# Altium schematic sheet draft.SchDoc
size A4; SheetNumber: 1; SheetTotal: 1
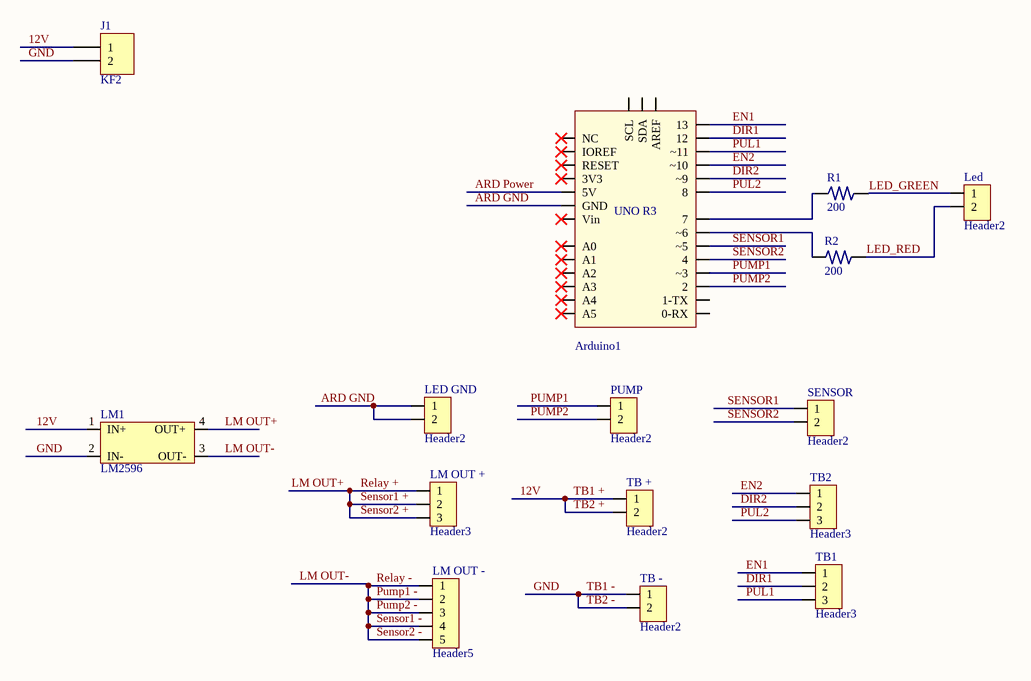
[diagram p0: draft.SchDoc]

## Parts
Arduino1  Arduino Uno R3  [Arduino UNO R3]  (value not drawn)
J1  KF2  [KF2-3.5]
Led  Header2  [HDR2]
LED_GND  Header2  [HDR2]
LM1  LM2596  [LM2596_Module]
LM_OUT_+  Header3  [HDR3]
LM_OUT_-  Header5  [HDR5]
PUMP  Header2  [HDR2]
R1  200  [RESISTOR 1/4W]
R2  200  [RESISTOR 1/4W]
SENSOR  Header2  [HDR2]
TB1  Header3  [HDR3]
TB2  Header3  [HDR3]
TB_+  Header2  [HDR2]
TB_-  Header2  [HDR2]

## Nets
12V: J1.1 LM1.1(IN+) TB_+.1 TB_+.2  [also labelled TB1 +, TB2 +]
ARD GND: Arduino1.GND LED_GND.1 LED_GND.2
ARD Power: Arduino1.5V
DIR1: Arduino1.12 TB1.2
DIR2: Arduino1.~9 TB2.2
EN1: Arduino1.13 TB1.1
EN2: Arduino1.~10 TB2.1
GND: J1.2 LM1.2(IN-) TB_-.1 TB_-.2  [also labelled TB1 -, TB2 -]
LED_GREEN: Led.1 R1.2
LED_RED: Led.2 R2.2
LM OUT+: LM1.4(OUT+) LM_OUT_+.1 LM_OUT_+.2 LM_OUT_+.3  [also labelled Relay +, Sensor1 +, Sensor2 +]
LM OUT-: LM1.3(OUT-) LM_OUT_-.1 LM_OUT_-.2 LM_OUT_-.3 LM_OUT_-.4 LM_OUT_-.5  [also labelled Pump1 -, Pump2 -, Relay -, Sensor1 -, Sensor2 -]
PUL1: Arduino1.~11 TB1.3
PUL2: Arduino1.8 TB2.3
PUMP1: Arduino1.~3 PUMP.1
PUMP2: Arduino1.2 PUMP.2
SENSOR1: Arduino1.~5 SENSOR.1
SENSOR2: Arduino1.4 SENSOR.2
NetArduino1_7: Arduino1.7 R1.1
NetArduino1_~6: Arduino1.~6 R2.1

Not connected (* = marked no-connect by the designer): Arduino1 0-RX 1-TX 3V3* A0* A1* A2* A3* A4* A5* AREF IOREF* NC* RESET* SCL SDA Vin*

## Notes on the sheet
- (in symbol Arduino Uno R3) UNO R3

## Library data of the parts
Arduino1 = Arduino Uno R3: Value: Cau 1A
J1 = KF2: Manufacturer: Würth Elektronik eiSos GmbH; partNo: 691103110002; ComponentLink1 Description: Manufacturer; ComponentLink2 Description: Datasheet; NoPins: 2; Created Date: 29 October 2013; ComponentLink1URL: http://www.we-online.com; ComponentLink2URL: http://katalog.we-online.de/em/datasheet/6911031100xx.pdf; Created by: Karrer Zheng
Led LED_GND PUMP SENSOR TB_+ TB_- = Header2: Header IDC, 2 x 1 Pin Vertical 2.54mm Pitch (Non-Boxed, Male); Manufacturer: W¨¹rth Elektronik eiSos GmbH; partNo: 613002143121; ComponentLink1 Description: Manufacturer; ComponentLink2 Description: Datasheet; NoPins: 02; Created Date: 29 March 2013; ComponentLink1URL: http://www.we-online.com; ComponentLink2URL: http://katalog.we-online.de/em/datasheet/6130xx143121.pdf; Created by: Karrer Zheng
LM1 = LM2596_Module
LM_OUT_+ TB1 TB2 = Header3: Header IDC, 3 x 1 Pin Vertical 2.54mm Pitch (Non-Boxed, Male); Manufacturer: W¨¹rth Elektronik eiSos GmbH; partNo: 613002143121; ComponentLink1 Description: Manufacturer; ComponentLink2 Description: Datasheet; NoPins: 02; Created Date: 29 March 2013; ComponentLink1URL: http://www.we-online.com; ComponentLink2URL: http://katalog.we-online.de/em/datasheet/6130xx143121.pdf; Created by: Karrer Zheng
LM_OUT_- = Header5: Header IDC, 5 x 1 Pin Vertical 2.54mm Pitch (Non-Boxed, Male); Manufacturer: W¨¹rth Elektronik eiSos GmbH; partNo: 613002143121; ComponentLink1 Description: Manufacturer; ComponentLink2 Description: Datasheet; NoPins: 02; Created Date: 29 March 2013; ComponentLink1URL: http://www.we-online.com; ComponentLink2URL: http://katalog.we-online.de/em/datasheet/6130xx143121.pdf; Created by: Karrer Zheng
R1 R2 = RESISTOR: Walt: 1/4W; Value: 200